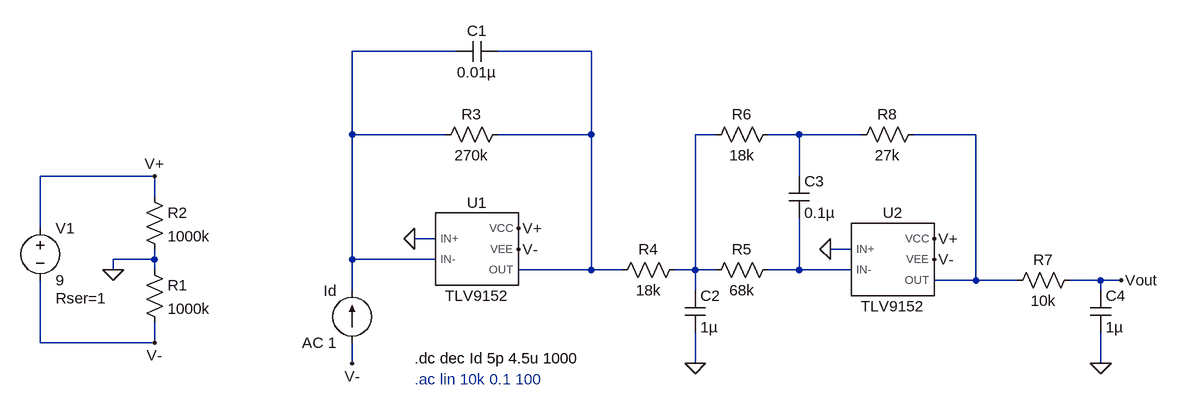
[diagram p0: schematic Photometer.asc]
Photometer.asc, the LTspice schematic file:
Version 4.1
SHEET 1 1836 680
WIRE 656 -176 496 -176
WIRE 864 -176 720 -176
WIRE 496 -48 496 -176
WIRE 640 -48 496 -48
WIRE 864 -48 864 -176
WIRE 864 -48 720 -48
WIRE 1056 -48 1024 -48
WIRE 1184 -48 1136 -48
WIRE 1280 -48 1184 -48
WIRE 1456 -48 1360 -48
WIRE 192 16 16 16
WIRE 1184 16 1184 -48
WIRE 192 48 192 16
WIRE 16 96 16 16
WIRE 624 112 592 112
WIRE 1264 128 1232 128
WIRE 192 144 192 128
WIRE 192 144 128 144
WIRE 496 144 496 -48
WIRE 624 144 496 144
WIRE 128 160 128 144
WIRE 192 160 192 144
WIRE 864 160 864 -48
WIRE 864 160 752 160
WIRE 912 160 864 160
WIRE 1024 160 1024 -48
WIRE 1024 160 992 160
WIRE 1056 160 1024 160
WIRE 1184 160 1184 80
WIRE 1184 160 1136 160
WIRE 1264 160 1184 160
WIRE 1456 176 1456 -48
WIRE 1456 176 1392 176
WIRE 1520 176 1456 176
WIRE 1648 176 1600 176
WIRE 1680 176 1648 176
WIRE 496 192 496 144
WIRE 1024 192 1024 160
WIRE 1648 192 1648 176
WIRE 16 272 16 176
WIRE 192 272 192 240
WIRE 192 272 16 272
WIRE 496 304 496 272
WIRE 1024 304 1024 256
WIRE 1648 304 1648 256
FLAG 128 160 0
FLAG 192 16 V+
FLAG 192 272 V-
FLAG 752 96 V+
FLAG 1392 112 V+
FLAG 752 128 V-
FLAG 1392 144 V-
FLAG 1680 176 Vout
FLAG 592 112 0
FLAG 1232 128 0
FLAG 496 304 V-
FLAG 1024 304 0
FLAG 1648 304 0
SYMBOL voltage 16 80 R0
WINDOW 123 0 0 Left 0
WINDOW 39 24 124 Left 2
SYMATTR SpiceLine Rser=1
SYMATTR InstName V1
SYMATTR Value 9
SYMBOL res 176 144 R0
SYMATTR InstName R1
SYMATTR Value 1000k
SYMATTR SpiceLine tol=10 pwr=0.25
SYMBOL res 176 32 R0
SYMATTR InstName R2
SYMATTR Value 1000k
SYMATTR SpiceLine tol=10 pwr=0.25
SYMBOL current 496 272 R180
WINDOW 0 24 80 Left 2
WINDOW 3 24 0 Left 2
WINDOW 123 0 0 Left 0
WINDOW 39 0 0 Left 0
SYMATTR InstName Id
SYMATTR Value AC 1
SYMBOL TLV9152 688 128 R0
SYMATTR InstName U1
SYMBOL TLV9152 1328 144 R0
SYMATTR InstName U2
SYMBOL res 736 -64 R90
WINDOW 0 0 56 VBottom 2
WINDOW 3 32 56 VTop 2
SYMATTR InstName R3
SYMATTR Value 270k
SYMATTR SpiceLine tol=10 pwr=0.25
SYMBOL cap 720 -192 R90
WINDOW 0 0 32 VBottom 2
WINDOW 3 32 32 VTop 2
SYMATTR InstName C1
SYMATTR Value 0.01µ
SYMBOL res 1008 144 R90
WINDOW 0 0 56 VBottom 2
WINDOW 3 32 56 VTop 2
SYMATTR InstName R4
SYMATTR Value 18k
SYMATTR SpiceLine tol=10 pwr=0.25
SYMBOL res 1152 -64 R90
WINDOW 0 0 56 VBottom 2
WINDOW 3 32 56 VTop 2
SYMATTR InstName R6
SYMATTR Value 18k
SYMATTR SpiceLine tol=10 pwr=0.25
SYMBOL res 1152 144 R90
WINDOW 0 0 56 VBottom 2
WINDOW 3 32 56 VTop 2
SYMATTR InstName R5
SYMATTR Value 68k
SYMATTR SpiceLine tol=10 pwr=0.25
SYMBOL cap 1008 192 R0
SYMATTR InstName C2
SYMATTR Value 1µ
SYMBOL cap 1168 16 R0
SYMATTR InstName C3
SYMATTR Value 0.1µ
SYMBOL cap 1632 192 R0
SYMATTR InstName C4
SYMATTR Value 1µ
SYMBOL res 1616 160 R90
WINDOW 0 0 56 VBottom 2
WINDOW 3 32 56 VTop 2
SYMATTR InstName R7
SYMATTR Value 10k
SYMATTR SpiceLine tol=10 pwr=0.25
SYMBOL res 1376 -64 R90
WINDOW 0 0 56 VBottom 2
WINDOW 3 32 56 VTop 2
SYMATTR InstName R8
SYMATTR Value 27k
SYMATTR SpiceLine tol=10 pwr=0.25
TEXT 592 296 Left 2 !.dc dec Id 5p 4.5u 1000
TEXT 592 328 Left 2 ;.ac lin 10k 0.1 100

The netlist it stands for:
* Photometer.asc
V1 V+ V- 9 Rser=1
R1 0 V- 1000k tol=10 pwr=0.25
R2 V+ 0 1000k tol=10 pwr=0.25
Id V- N001 AC 1
X§U1 0 N001 V+ V- N002 TLV9152  ; pins IN+ IN- VCC VEE OUT
X§U2 0 N006 V+ V- N005 TLV9152  ; pins IN+ IN- VCC VEE OUT
R3 N002 N001 270k tol=10 pwr=0.25
C1 N002 N001 0.01µ
R4 N003 N002 18k tol=10 pwr=0.25
R6 N004 N003 18k tol=10 pwr=0.25
R5 N006 N003 68k tol=10 pwr=0.25
C2 N003 0 1µ
C3 N004 N006 0.1µ
C4 Vout 0 1µ
R7 Vout N005 10k tol=10 pwr=0.25
R8 N005 N004 27k tol=10 pwr=0.25
.dc dec Id 5p 4.5u 1000
* .ac lin 10k 0.1 100
.lib C:\Users\Luigi\Downloads\sbomb53b\tlv9152.lib
.backanno
.end